# Altium schematic sheet LORA.SchDoc
size A4; SheetNumber: 5; SheetTotal: 10
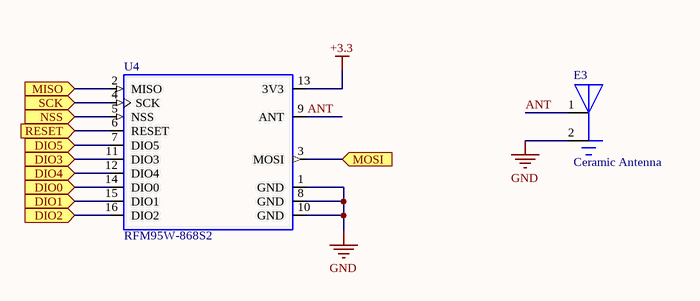
[diagram p0: LORA.SchDoc]

## Parts
E3  Ceramic Antenna  [Ceramic_915M]
U4  RFM95W-868S2  [XCVR_RFM95W-868S2]

## Ports
DIO0 (in), DIO1 (in), DIO2 (in), DIO3 (in), DIO4 (in), DIO5 (in), MISO (in), MOSI (in), NSS (in), RESET (in), SCK (in)

## Nets
+3.3: U4.13(3V3)
GND: E3.2 U4.1(GND) U4.8(GND) U4.10(GND)
ANT: E3.1 U4.9(ANT)
DIO0: U4.14(DIO0) ; port DIO0
DIO1: U4.15(DIO1) ; port DIO1
DIO2: U4.16(DIO2) ; port DIO2
DIO3: U4.11(DIO3) ; port DIO3
DIO4: U4.12(DIO4) ; port DIO4
DIO5: U4.7(DIO5) ; port DIO5
MISO: U4.2(MISO) ; port MISO
MOSI: U4.3(MOSI) ; port MOSI
NSS: U4.5(NSS) ; port NSS
RESET: U4.6(RESET) ; port RESET
SCK: U4.4(SCK) ; port SCK

## Library data of the parts
U4 = RFM95W-868S2: General ISM < 1GHz LoRa Transceiver Module 868MHz Antenna Not Included Surface Mount; MF: RF; Availability: Unavailable; Price: None; Package: SMD-16 Hope Microelectronics; MP: RFM95W-868S2; Value: *; SnapEDA_Link: https://www.snapeda.com/parts/RFM95W-868S2/RF%20Solutions/view-part/329180/?ref=snap